# EAGLE design MSMGDustSensor (EAGLE 8.3.1)
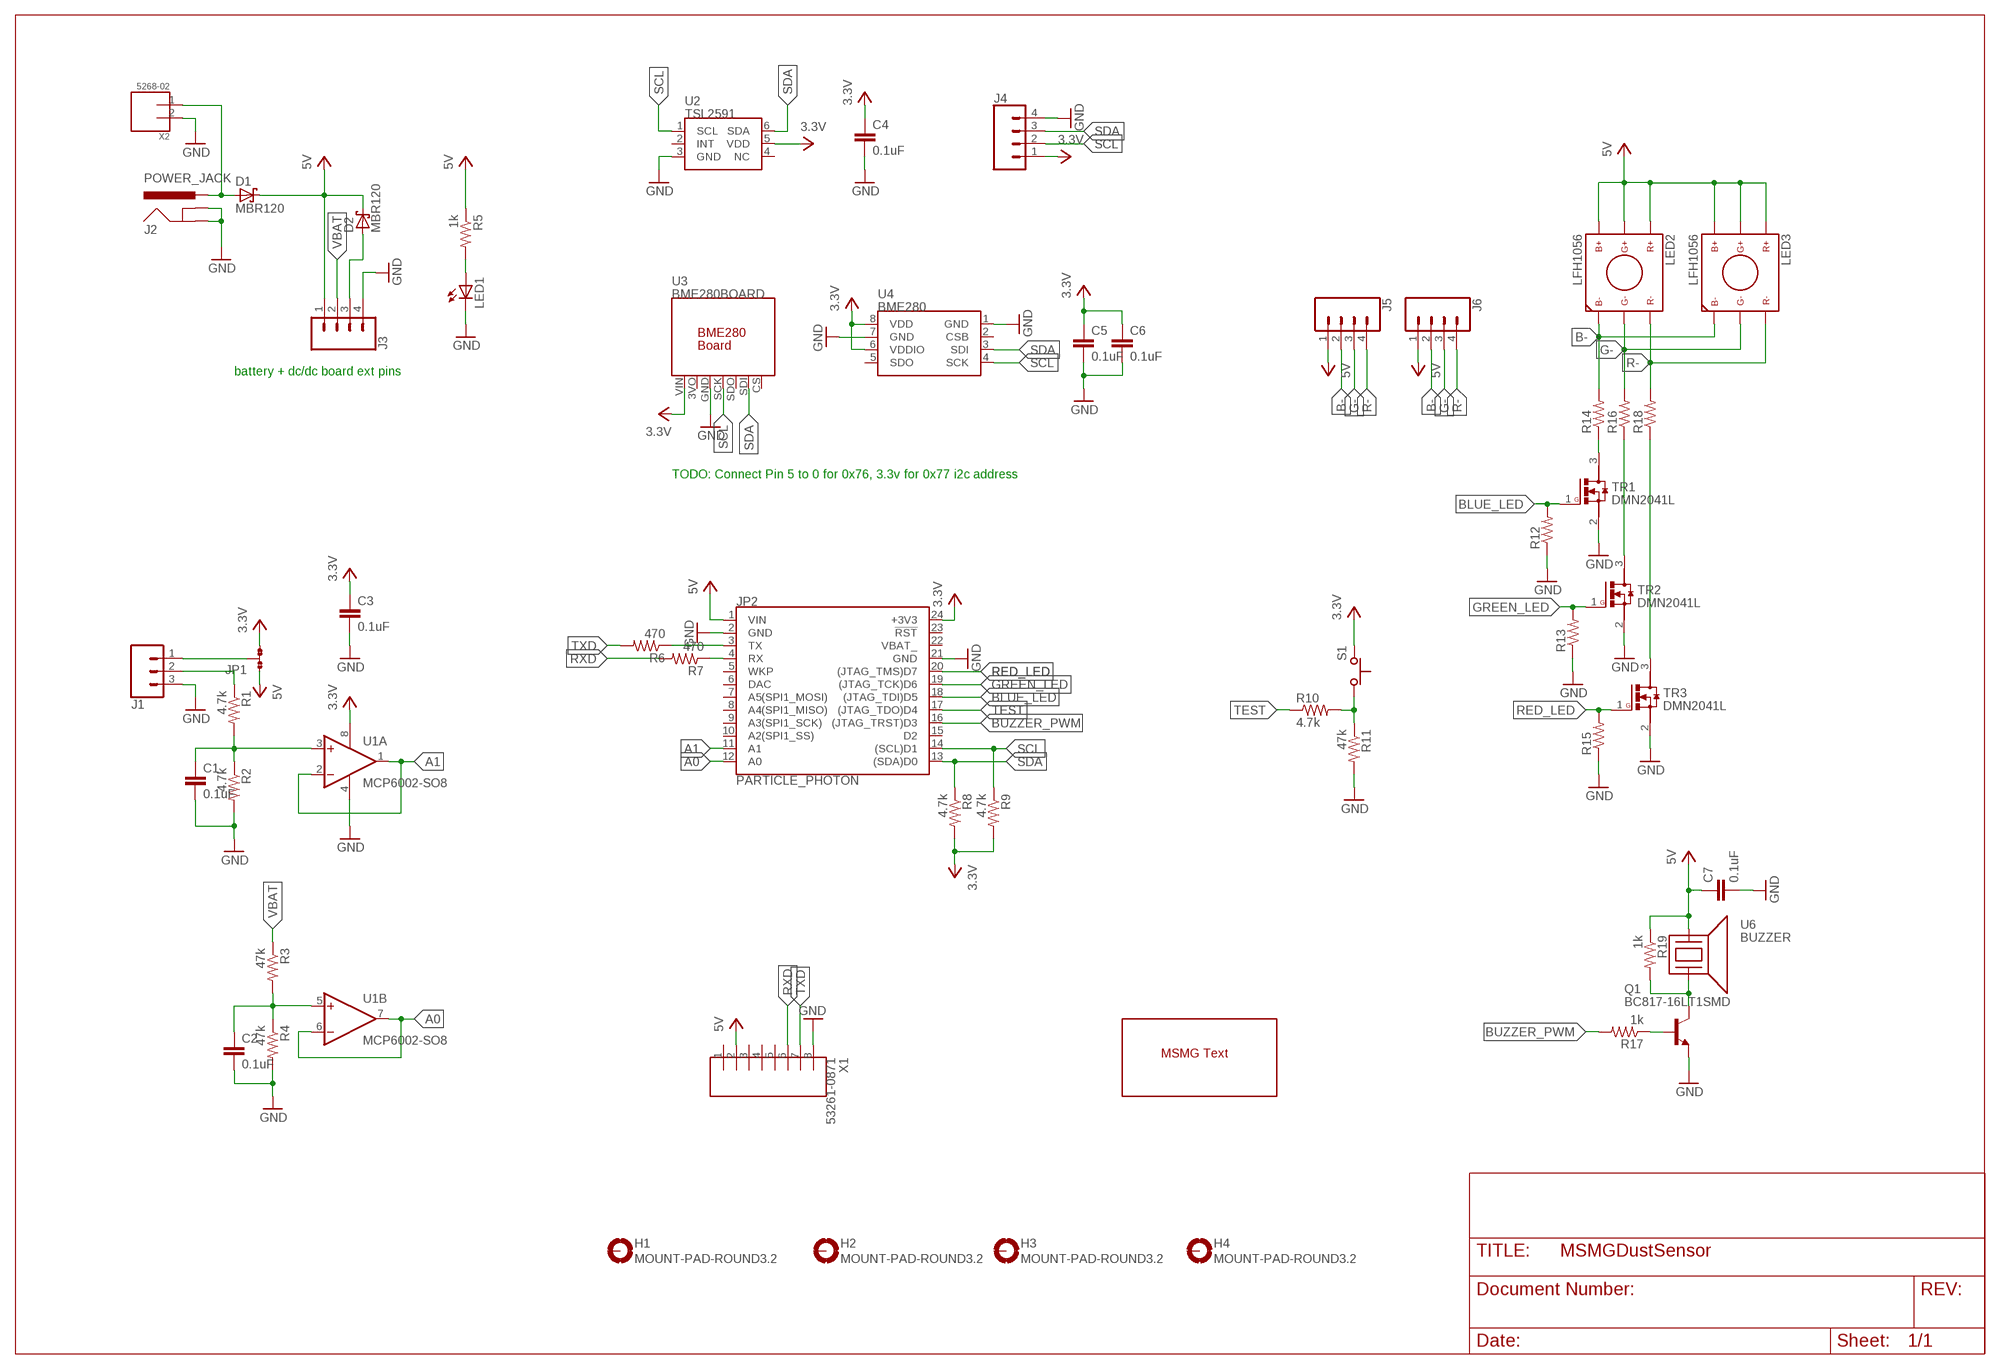
[diagram p0: schematic, sheet 1]

## Parts
C1  0.1uF  C0603(1608)  [C0603(1608)]
C2  0.1uF  C0603(1608)  [C0603(1608)]
C3  0.1uF  C0603(1608)  [C0603(1608)]
C4  0.1uF  C0603(1608)  [C0603(1608)]
C5  0.1uF  C0603(1608)  [C0603(1608)]
C6  0.1uF  C0603(1608)  [C0603(1608)]
C7  0.1uF  C0603(1608)  [C0603(1608)]
D1  MBR120  [SOD-123]
D2  MBR120  [SOD-123]
H1  MOUNT-PAD-ROUND3.2  [3,2-PAD]
H2  MOUNT-PAD-ROUND3.2  [3,2-PAD]
H3  MOUNT-PAD-ROUND3.2  [3,2-PAD]
H4  MOUNT-PAD-ROUND3.2  [3,2-PAD]
J1  CONN_03  [1X03]
J2  POWER_JACK  [POWER_JACK_PTH]
J3  CONN_04  [1X04]
J4  CONN_04  [1X04]
J5  CONN_04  [1X04]
J6  CONN_04  [1X04]
JP1  JP2  [JP2SMD0603]
JP2  PARTICLE_PHOTON  [PARTICLE_PHOTON]
LED1  LED3MM  [LED3MM]
LED2  LFH1056  [LFH1056]
LED3  LFH1056  [LFH1056]
Q1  BC817-16LT1SMD  [SOT23-BEC]
R1  4.7k  R0603(1608)  [R0603(1608)]
R2  4.7k  R0603(1608)  [R0603(1608)]
R3  47k  R0603(1608)  [R0603(1608)]
R4  47k  R0603(1608)  [R0603(1608)]
R5  1k  R0603(1608)  [R0603(1608)]
R6  470  R0603(1608)  [R0603(1608)]
R7  470  R0603(1608)  [R0603(1608)]
R8  4.7k  R0603(1608)  [R0603(1608)]
R9  4.7k  R0603(1608)  [R0603(1608)]
R10  4.7k  R0603(1608)  [R0603(1608)]
R11  47k  R0603(1608)  [R0603(1608)]
R12  R0603(1608)  [R0603(1608)]
R13  R0603(1608)  [R0603(1608)]
R14  R0603(1608)  [R0603(1608)]
R15  R0603(1608)  [R0603(1608)]
R16  R0603(1608)  [R0603(1608)]
R17  1k  R0603(1608)  [R0603(1608)]
R18  R0603(1608)  [R0603(1608)]
R19  1k  R0603(1608)  [R0603(1608)]
S1  SWITCH  [SKHLACA010]
TR1  DMN2041L  [SOT23]
TR2  DMN2041L  [SOT23]
TR3  DMN2041L  [SOT23]
U1  MCP6002-SO8  [SO8]
U2  TSL2591  [DFN-6]
U3  BME280BOARD  [BME280BOARD]
U4  BME280  [BME280]
U6  BUZZER  [PS1240]
U$1  MSMG_TEXT  [MSMG_TEXT]
X1  53261-0871  [53261-0871]
X2  5268-02  [5628-02]

## Nets
3.3V: C3.1 C4.1 C5.1 C6.1 J4.1 JP1.3 JP2.24(+3V3) R8.2 R9.2 S1.P$1 U1.8(V+) U2.5(VDD) U3.VIN U4.6(VDDIO) U4.8(VDD)
5V: C7.1 D1.C D2.C J3.1 J5.1 J6.1 JP1.1 JP2.1(VIN) LED2.B+ LED2.G+ LED2.R+ LED3.B+ LED3.G+ LED3.R+ R5.1 R19.1 U6.1 X1.2
A0: JP2.12(A0) U1.6(B:-IN) U1.7(B:OUT)
A1: JP2.11(A1) U1.1(A:OUT) U1.2(A:-IN)
B-: J5.2 J6.2 LED2.B- LED3.B- R14.2
BLUE_LED: JP2.18((JTAG_TDI)D5) R12.2 TR1.1(G)
BUZZER_PWM: JP2.16((JTAG_TRST)D3) R17.2
G-: J5.3 J6.3 LED2.G- LED3.G- R16.2
GND: C1.2 C2.2 C3.2 C4.2 C5.2 C6.2 C7.2 J1.3 J2.GND J2.GNDBREAK J3.4 J4.4 JP2.2(GND) JP2.21(GND) LED1.K(C) Q1.E R2.2 R4.2 R11.2 R12.1 R13.1 R15.1 TR1.2(S) TR2.2(S) TR3.2(S) U1.4(V-) U2.3(GND) U3.GND U4.1(GND) U4.7(GND) X1.8 X2.2
GREEN_LED: JP2.19((JTAG_TCK)D6) R13.2 TR2.1(G)
N$1: D1.A J2.PWR X2.1
N$2: D2.A J3.3
N$4: J1.2 R1.1
N$5: JP2.3(TX) R6.1
N$7: J1.1 JP1.2
N$9: JP2.4(RX) R7.1
N$10: R14.1 TR1.3(D)
N$11: R10.2 R11.1 S1.P$2
N$12: R16.1 TR2.3(D)
N$13: Q1.C R19.2 U6.2
N$14: C2.1 R3.2 R4.1 U1.5(B:+IN)
N$15: R18.1 TR3.3(D)
N$16: C1.1 R1.2 R2.1 U1.3(A:+IN)
N$17: LED1.A R5.2
N$18: Q1.B R17.1
R-: J5.4 J6.4 LED2.R- LED3.R- R18.2
RED_LED: JP2.20((JTAG_TMS)D7) R15.2 TR3.1(G)
RXD: R7.2 X1.6
SCL: J4.2 JP2.14((SCL)D1) R9.1 U2.1(SCL) U3.SCK U4.4(SCK)
SDA: J4.3 JP2.13((SDA)D0) R8.1 U2.6(SDA) U3.SDI U4.3(SDI)
TEST: JP2.17((JTAG_TDO)D4) R10.1
TXD: R6.2 X1.7
VBAT: J3.2 R3.1
Unconnected: H1.B3,2(MOUNT) H2.B3,2(MOUNT) H3.B3,2(MOUNT) H4.B3,2(MOUNT) JP2.5(WKP) JP2.6(DAC) JP2.7(A5(SPI1_MOSI)) JP2.8(A4(SPI1_MISO)) JP2.9(A3(SPI1_SCK)) JP2.10(A2(SPI1_SS)) JP2.15(D2) JP2.23(!RST!) U2.2(INT) U2.4(NC) U3.3VO U3.CS U3.SDO U4.2(CSB) U4.5(SDO) X1.1 X1.3 X1.4 X1.5

## Notes on the sheet
- battery + dc/dc board ext pins
- TODO: Connect Pin 5 to 0 for 0x76, 3.3v for 0x77 i2c address

## Power pins joined to a net without a drawn wire
VBAT_: JP2.22(VBAT_)

## Library data of the parts
C1-C7 = MSMG:C
D1 D2 = MSMG:MBR120
H1-H4 = holes:MOUNT-PAD-ROUND: MOUNTING PAD, round
J1 = SparkFun-Connectors:CONN_03: Multi connection point. Often used as Generic Header-pin footprint for 0.1 inch spaced/style header connections On any of the 0.1 inch spaced packages, you can populate with these: Break Away Headers - Straight <https://www.sparkfun.com/products/116> (PRT-00116) Break Away Male Headers - Right Angle <https://www.sparkfun.com/products/553> (PRT-00553) Female Headers <https://www.sparkfun.com/products/115> (PRT-00115) Break Away Headers - Machine Pin <https://www.sparkfun.com/products/117> (PRT-00117) Break Away Female Headers - Swiss Machine Pin <https://www.sparkfun.com/products/743> (PRT-00743) Stackable Header - 3 Pin (Female, 0.1") <https://www.sparkfun.com/products/13875> (PRT-13875) For SCREWTERMINALS and SPRING TERMINALS visit here: Screw Terimnals on SparkFun.com <https://www.sparkfun.com/search/results?term=Screw+Terminals> (5mm/3.5mm/2.54mm spacing) This device is also useful as a general connection point to wire up your design to another part of your project. Our various solder wires solder well into these plated through hole pads. Hook-Up Wire - Assortment (Stranded, 22 AWG) <https://www.sparkfun.com/products/11375> (PRT-11375) Hook-Up Wire - Assortment (Solid Core, 22 AWG) <https://www.sparkfun.com/products/11367> (PRT-11367) View the entire wire category on our website here <https://www.sparkfun.com/categories/141> Special notes: Molex polarized connector foot print use with SKU : PRT-08232 with associated crimp pins and housings.
J2 = MSMG:POWER_JACK: Power Jack Connector This is the standard 5.5mm barrel jack for power. The PTH is the most common, proven, reliable, footprint. The Slot footprint only works if the mill layer is transmitted to the PCB fab house so be warned. Here are the connectors we sell at SparkFun: DC Barrel Power Jack/Connector <https://www.sparkfun.com/products/119> (PRT-00119) DC Barrel Power Jack/Connector (SMD) <https://www.sparkfun.com/products/12748> (PRT-12748) DC Barrel Jack Adapter - Breadboard Compatible <https://www.sparkfun.com/products/10811> (PRT-10811) It is used on this SparkFun product (and many, many others): SparkFun RedBoard - Programmed with Arduino <https://www.sparkfun.com/products/12757> (DEV-12757) Also, if you need a mating power supply or connector, please check these out: Wall Adapter Power Supply - 9VDC 650mA <https://www.sparkfun.com/products/298> (TOL-00298) DC Barrel Jack Adapter - Male <https://www.sparkfun.com/products/10287> (PRT-10287); PROD_ID: CONN-08197
J3-J6 = SparkFun-Connectors:CONN_04: Multi connection point. Often used as Generic Header-pin footprint for 0.1 inch spaced/style header connections On any of the 0.1 inch spaced packages, you can populate with these: Break Away Headers - Straight <https://www.sparkfun.com/products/116> (PRT-00116) Break Away Male Headers - Right Angle <https://www.sparkfun.com/products/553> (PRT-00553) Female Headers <https://www.sparkfun.com/products/115> (PRT-00115) Break Away Headers - Machine Pin <https://www.sparkfun.com/products/117> (PRT-00117) Break Away Female Headers - Swiss Machine Pin <https://www.sparkfun.com/products/743> (PRT-00743) For SCREWTERMINALS and SPRING TERMINALS visit here: Screw Terimnals on SparkFun.com <https://www.sparkfun.com/search/results?term=Screw+Terminals> (5mm/3.5mm/2.54mm spacing) This device is also useful as a general connection point to wire up your design to another part of your project. Our various solder wires solder well into these plated through hole pads. Hook-Up Wire - Assortment (Stranded, 22 AWG) <https://www.sparkfun.com/products/11375> (PRT-11375) Hook-Up Wire - Assortment (Solid Core, 22 AWG) <https://www.sparkfun.com/products/11367> (PRT-11367) View the entire wire category on our website here <https://www.sparkfun.com/categories/141> Special notes: Molex polarized connector foot print use with SKU : PRT-08231 with associated crimp pins and housings. 1MM SMD Version SKU: PRT-10208; PROD_ID: CONN-09696
JP1 = GFE:JP2
JP2 = MSMG:PARTICLE_PHOTON: Particle Photon Footprint of the Particle Photon that is used as a basis for many Photon shields. SparkFun Products: Particle Photon <https://www.sparkfun.com/products/13764> SparkFun Photon ProtoShield <https://www.sparkfun.com/products/13598> SparkFun Photon micro OLED Shield <https://www.sparkfun.com/products/13628> SparkFun Photon IMU Shield <https://www.sparkfun.com/products/13629> SparkFun Photon Battery Shield <https://www.sparkfun.com/products/13626>
LED1 = MSMG:LED: LEDs Standard schematic elements and footprints for 5mm, 3mm, 1206, and 0603 sized LEDs. 5mm - Spark Fun Electronics SKU : COM-00529 (and others)
LED2 LED3 = MSMG:LFH1056: Luxpia LFH1056
Q1 = MSMG:BC817*: NPN Transistor
R1-R19 = MSMG:R
S1 = WaterDrop:SWITCH
TR1-TR3 = MSMG:DMN2041L
U1 = MSMG:MCP6002
U2 = MSMG:TSL2591
U3 = MSMG:BME280BOARD
U4 = MSMG:BME280: BME280 - Environmental Sensor (I2C + SPI)
U6 = MSMG:BUZZER
U$1 = MSMG:MSMG_TEXT
X1 = MSMG:53261-0871
X2 = OSSI:5268-02

## Board
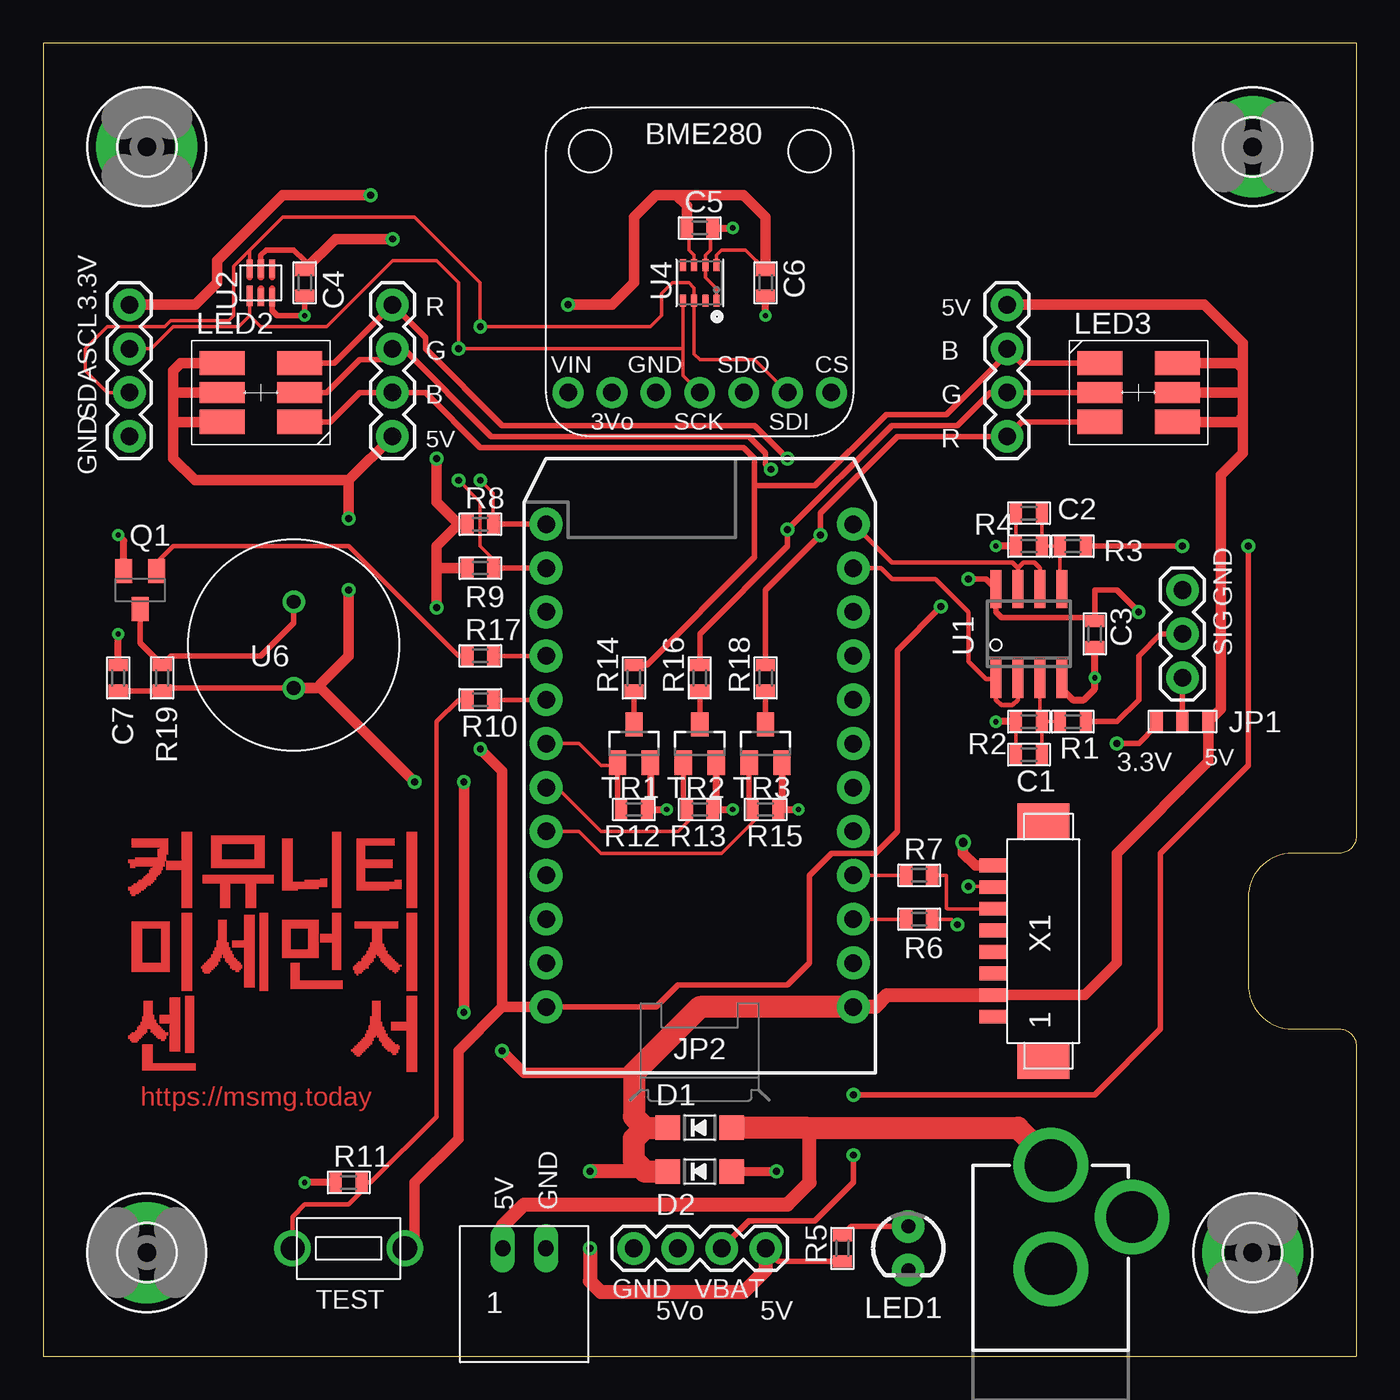
[diagram p1: board, top side]
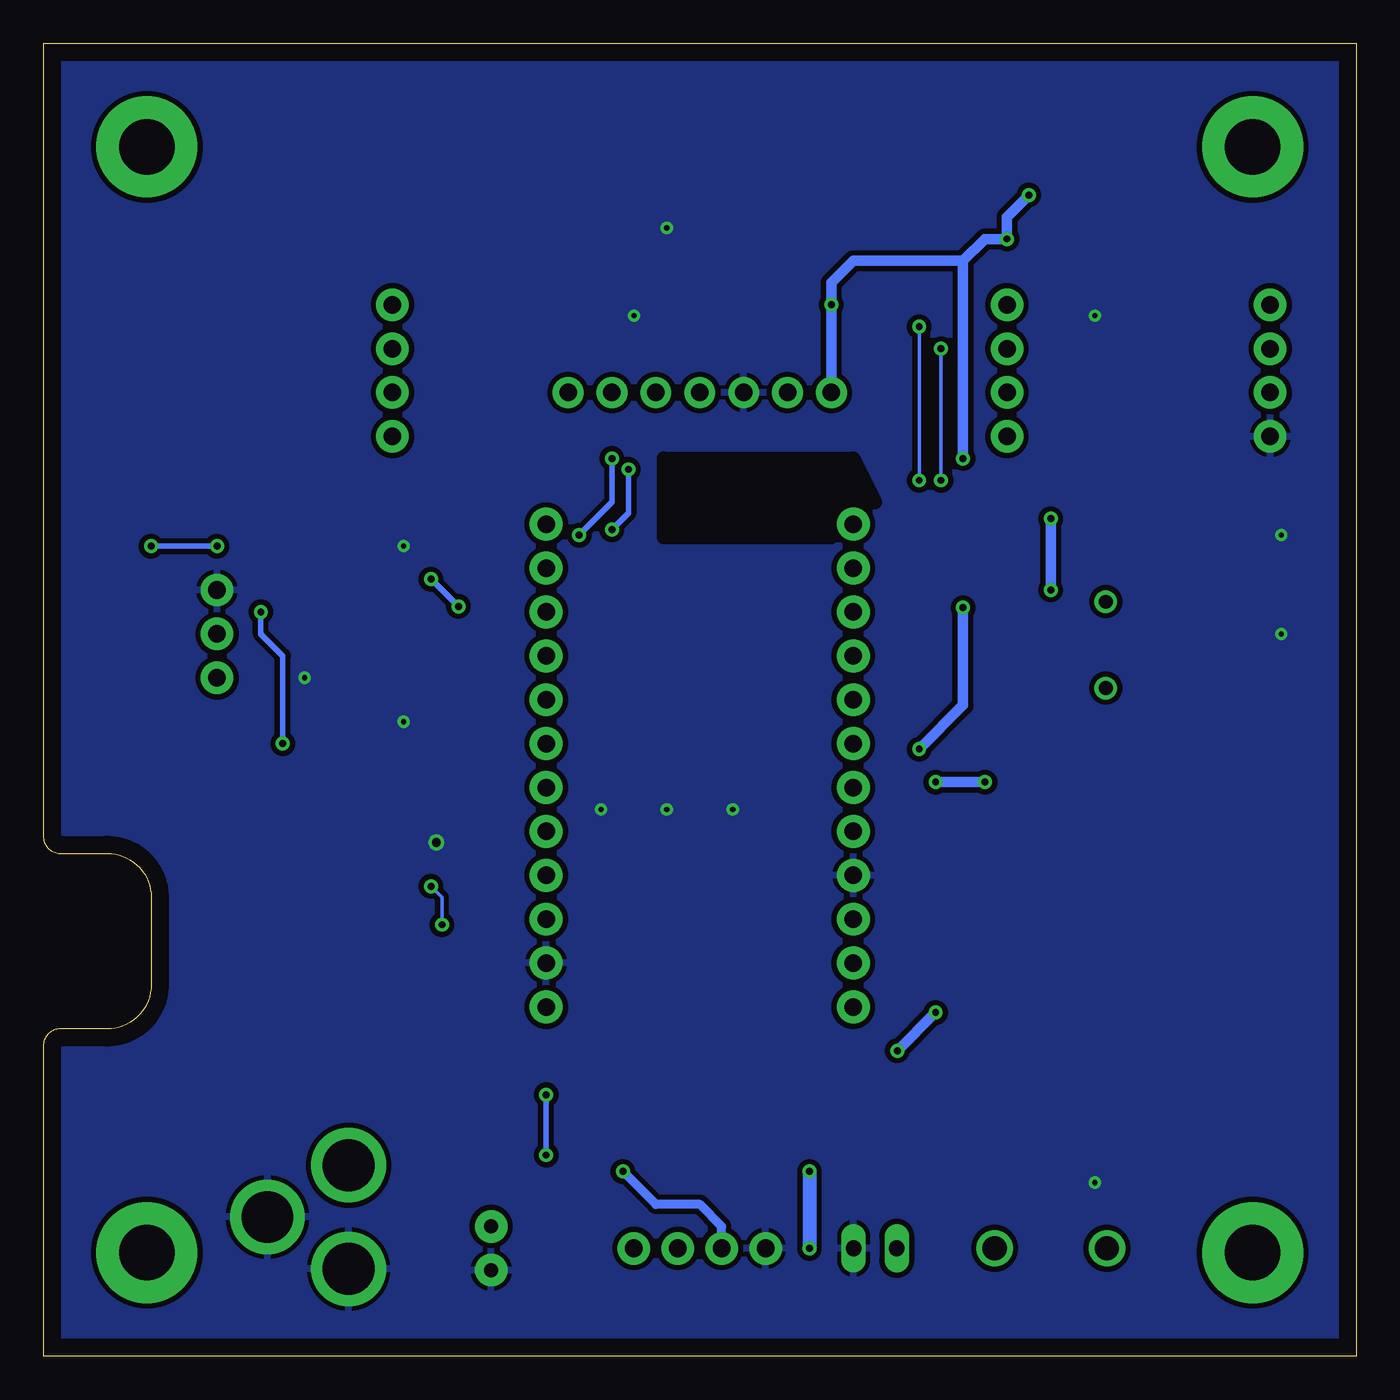
[diagram p2: board, bottom side, seen from below]

Size 76 x 76 mm. Coordinates in mm from the lower left corner, seen from the top.
Outline: 0,0 76,0 76,17.95 arc90 75,18.95 72.29,18.95 arc-90 69.75,21.49 69.75,26.57 arc-90 72.29,29.11 75,29.11 arc90 76,30.11 76,76 0,76 0,0
Copper layers (1*16): Top 0.035mm / dielectric 1.5mm / Bottom 0.035mm
Design rules "default *": minimum track width 6mil, minimum drill 0.3mm, track to track 6mil, track to pad 6mil, pad to pad 6mil, via to via 6mil, smd to smd 6mil, copper to edge 40mil, drill to drill 6mil, minimum pad ring 10mil, minimum via ring 8mil, stop-mask expansion 4mil, vias tented up to drill 0mil, thermal gap 10mil

### Footprints (pad centres in the part's own frame; a part is rotated, then mirrored left to right if it is on the bottom)
C0603(1608) = smd 0.7 x 1.1: 1 -0.75,0; 2 0.75,0
SOD-123 = smd 1.4 x 1.4: A 1.85,0; C -1.85,0
3,2-PAD = drill 3.2 pad 5.842: B3,2 0,0
1X03 = drill 1.016 pad 1.88: 1 0,0; 2 2.54,0; 3 5.08,0
POWER_JACK_PTH = drill 2.997 pad 4.318: GND 0,7.7; GNDBREAK 4.7,10.7; PWR 0,13.7
1X04 = drill 1.016 pad 1.88: 1 0,0; 2 2.54,0; 3 5.08,0; 4 7.62,0
JP2SMD0603 = smd 0.7 x 1.1: 1 -1.5,0; 2 0,0; 3 1.5,0
PARTICLE_PHOTON = drill 1.016 pad 1.905: 1 -8.89,13.97; 2 -8.89,11.43; 3 -8.89,8.89; 4 -8.89,6.35; 5 -8.89,3.81; 6 -8.89,1.27; 7 -8.89,-1.27; 8 -8.89,-3.81; 9 -8.89,-6.35; 10 -8.89,-8.89; 11 -8.89,-11.43; 12 -8.89,-13.97; 13 8.89,-13.97; 14 8.89,-11.43; 15 8.89,-8.89; 16 8.89,-6.35; 17 8.89,-3.81; 18 8.89,-1.27; 19 8.89,1.27; 20 8.89,3.81; 21 8.89,6.35; 22 8.89,8.89; 23 8.89,11.43; 24 8.89,13.97
LED3MM = drill 0.813 pad 1.88: A -1.27,0; K 1.27,0
LFH1056 = smd 2.6 x 1.4: B+ -2.25,-1.7; B- 2.25,-1.7; R+ -2.25,1.7; R- 2.25,1.7 | smd 2.6 x 1.2: G+ -2.25,0; G- 2.25,0
SOT23-BEC = smd 1 x 1.4: B -0.95,-1.1; C 0,1.1; E 0.95,-1.1
R0603(1608) = smd 0.7 x 1.1: 1 -0.75,0; 2 0.75,0
SKHLACA010 = drill 1.4: P$1 -3.25,0; P$2 3.25,0
SOT23 = smd 1 x 1.4: 1 -0.95,-1.1; 2 0.95,-1.1; 3 0,1.1
SO8 = smd 0.65 x 2.2: 1 -1.905,-2.6; 2 -0.635,-2.6; 3 0.635,-2.6; 4 1.905,-2.6; 5 1.905,2.6; 6 0.635,2.6; 7 -0.635,2.6; 8 -1.905,2.6
DFN-6 = smd 1.2 x 0.35: 1 -0.75,0.65 | smd 1.025 x 0.35: 2 -0.838,0; 3 -0.838,-0.65; 4 0.838,-0.65; 5 0.838,0; 6 0.838,0.65
BME280BOARD = drill 1.016 pad 1.778: 3VO 3.81,2.54; CS 16.51,2.54; GND 6.35,2.54; SCK 8.89,2.54; SDI 13.97,2.54; SDO 11.43,2.54; VIN 1.27,2.54
BME280 = smd 0.7 x 0.35: 1 1.025,0.975; 2 1.025,0.325; 3 1.025,-0.325; 4 1.025,-0.975; 5 -1.025,-0.975; 6 -1.025,-0.325; 7 -1.025,0.325; 8 -1.025,0.975
PS1240 = drill 0.8: 1 -2.5,0; 2 2.5,0
53261-0871 = smd 0.8 x 1.6: 1 -4.375,0.8; 2 -3.125,0.8; 3 -1.875,0.8; 4 -0.625,0.8; 5 0.625,0.8; 6 1.875,0.8; 7 3.125,0.8; 8 4.375,0.8 | smd 2.1 x 3: P$9 -6.925,-2.1; P$10 6.925,-2.1
5628-02 = drill 0.9 long: 1 1.25,0; 2 -1.25,0

### Placement (x,y rotation side)
C1  57.05,34.83 180 top
C2  57.05,48.8 180 top
C3  60.86,41.81 270 top
C4  15.14,62.13 270 top
C5  38,65.31 0 top
C6  41.81,62.13 270 top
C7  4.34,39.27 90 top
D1  38,13.23 0 top
D2  38,10.7 0 top
H1  6,70 45 top
H2  70,6 45 top
H3  6,6 315 top
H4  70,70 315 top
J1  65.94,39.27 90 top
J2  58.32,-2.64 0 top
J3  41.81,6.25 180 top
J4  4.98,60.86 270 top
J5  20.22,53.24 90 top
J6  55.78,60.86 270 top
JP1  65.94,36.73 180 top
JP2  38,34.19 180 top
LED1  50.06,6.25 270 top
LED2  12.6,55.78 0 top
LED3  63.4,55.78 180 top
Q1  5.62,44.35 180 top
R1  59.59,36.73 180 top
R2  57.05,36.73 180 top
R3  59.59,46.89 180 top
R4  57.05,46.89 180 top
R5  46.26,6.25 90 top
R6  50.7,25.3 0 top
R7  50.7,27.84 0 top
R8  25.3,48.16 180 top
R9  25.3,45.62 180 top
R10  25.3,38 180 top
R11  17.68,10.06 180 top
R12  34.19,31.65 180 top
R13  38,31.65 180 top
R14  34.19,39.27 90 top
R15  41.81,31.65 180 top
R16  38,39.27 90 top
R17  25.3,40.54 0 top
R18  41.81,39.27 90 top
R19  6.89,39.27 90 top
S1  17.68,6.25 180 top
TR1  34.19,35.46 0 top
TR2  38,35.46 0 top
TR3  41.81,35.46 0 top
U1  57.05,41.81 0 top
U2  12.6,62.13 90 top
U3  29.11,53.24 0 top
U4  38,62.13 270 top
U6  14.5,41.17 90 top
U$1  4.98,16.41 0 top
X1  55.78,24.03 90 top
X2  27.84,6.25 180 top

### Tracks (layer width: path | path; a pad name or v marks a point on that pad's centre or on a via)
3.3V  (via drill 0.4)
  Top 0.2: U4.6 37.67,63.73 37.37,64.03 37.37,65.19 C5.1 | U4.8 38.98,63.74 39.27,64.03 40.66,64.03 C6.1
  Top 0.305: C4.1 15.14,63.4 14.5,64.03 12.92,64.03 12.6,63.72 U2.5 | JP2.24 35.46,20.22 36.73,21.49 43.08,21.49 44.35,22.76 44.35,27.84 45.62,29.11 48.16,29.11 49.43,30.38 49.43,40.86 v51.97,43.4 | v53.56,44.98 54.57,44.98 U1.8 55.14,43.08 55.46,42.76 60.66,42.76 C3.1 60.86,44.35 62.13,44.35 v63.4,43.08 | JP1.3 64.44,36.5 63.4,35.46 v62.13,35.46
  Top 0.61: 26.57,20.22 JP2.24 | 26.57,20.22 24.03,17.68 24.03,12.6 21.49,10.06 21.49,6.81 S1.P$1 | 26.57,20.22 26.57,33.87 v25.3,35.14 | 22.76,45.62 v22.76,43.33 | 22.76,45.62 22.76,46.89 24.03,48.16 | R9.2 22.76,45.62 | R8.2 24.03,48.16 | 24.03,48.16 22.76,49.43 v22.76,51.97 | v20.22,64.67 16.93,64.67 C4.1 | C6.1 41.81,65.94 40.54,67.21 36.63,67.21 | 36.63,67.21 35.46,67.21 34.19,65.94 34.19,62.13 32.92,60.86 v30.38,60.86 | C5.1 37.25,66.59 36.63,67.21 | J4.1 8.79,60.86 10.06,62.13 10.06,63.4 13.87,67.21 v18.95,67.21
  Bottom 0.305: v51.97,43.4 v53.56,44.98 | v62.13,35.46 62.13,40.54 63.4,41.81 v63.4,43.08
  Bottom 0.61: v25.3,35.14 22.76,37.68 v22.76,43.33 22.76,43.4 | 22.76,63.31 v22.76,51.97 | 22.76,63.31 22.76,63.4 21.49,64.67 20.42,64.67 | 20.42,64.67 v20.22,64.67 | U3.VIN v30.38,60.86 30.38,62.13 29.11,63.4 22.85,63.4 22.76,63.31 | v18.95,67.21 20.22,65.94 20.22,64.87 20.42,64.67
5V  (via drill 0.4)
  Top 0.305: U6.1 7.04,38.67 R19.1 C7.1 | R5.1 42.56,5.5 J3.1 | 35.46,10.7 35.47,10.7
  Top 0.61: X1.2 60.27,20.91 62.13,22.76 62.13,29.11 67.44,34.42 JP1.1 68.16,37.45 68.16,51.02 69.43,52.29 69.43,54.38 | J6.1 67.21,60.86 69.43,58.64 69.43,57.17 | 69.43,55.97 69.43,57.17 | 69.43,54.38 69.43,55.97 | LED3.B+ 69.12,57.48 69.43,57.17 | LED3.G+ 69.24,55.78 69.43,55.97 | LED3.R+ 69.13,54.08 69.43,54.38 | LED2.R+ 7.95,57.48 7.52,57.05 7.52,55.57 | 7.52,54.1 7.52,55.57 | 7.52,54.1 7.52,51.97 8.79,50.7 17.68,50.7 | LED2.G+ 7.73,55.78 7.52,55.57 | LED2.B+ 7.54,54.08 7.52,54.1 | 17.68,50.7 J5.1 | 34.19,16.41 27.84,16.41 v26.57,17.68 | v24.35,19.9 v24.35,33.24 | U6.1 16.05,38.67 | 16.05,38.67 v21.49,33.24 | 16.05,38.67 16.05,38.91 17.68,40.54 v17.68,44.35 | v17.68,48.48 17.68,50.7
  Top 0.813: X1.2 48.84,20.91 48.16,20.22 JP2.1 | J3.1 41.81,4.98 40.54,3.71 32.28,3.71 31.65,4.34 v31.65,6.25 | 35.46,10.7 v31.65,10.7
  Top 1.27: 34.83,13.23 D1.C | 34.83,13.23 34.19,12.6 34.19,11.33 34.83,10.7 35.46,10.7 | 35.47,10.7 D2.C | JP2.1 38,20.22 34.19,16.41 34.19,13.87 34.83,13.23
  Bottom 0.61: v26.57,17.68 v24.35,19.9 | v24.35,33.24 v21.49,33.24 | v17.68,44.35 v17.68,48.48
  Bottom 0.813: v31.65,10.7 v31.65,6.25
A0
  Top 0.254: U1.6 57.69,45.62 57.37,45.94 56.73,45.94 56.41,45.62 | 56.41,45.62 U1.7 | JP2.12 49.11,45.94 56.1,45.94 56.41,45.62
A1
  Top 0.254: U1.2 56.41,38 56.1,37.68 55.46,37.68 55.14,38 U1.1 54.57,39.21 53.56,40.22 53.56,43.08 51.65,44.98 49.11,44.98 48.48,45.62 JP2.11
B-
  Top 0.305: LED3.B- 56.62,57.48 J6.2 55.78,58 52.29,54.51 48.8,54.51 44.67,50.38 41.17,50.38 | LED2.B- 16.61,54.08 18.32,55.78 J5.2 22.12,55.78 25.3,52.61 40.54,52.61 41.17,51.97 41.17,50.38 | 41.17,50.38 41.17,46.26 34.94,40.02 R14.2
BLUE_LED
  Top 0.2: JP2.18 31.02,35.46 32.28,34.19 33.07,34.19 TR1.1
  Top 0.305: TR1.1 33.24,31.85 R12.2
BUZZER_PWM
  Top 0.254: JP2.16 R17.2
G-  (via drill 0.4)
  Top 0.305: LED3.G- J6.3 54.83,55.78 52.92,53.88 49.11,53.88 v43.08,47.84 43.08,46.89 38,41.81 R16.2 | LED2.G- 16.41,55.78 18.32,57.69 19.59,57.69 J5.3 20.86,58.32 25.94,53.24 40.86,53.24 41.81,52.29 41.81,51.65 v42.13,51.34
  Bottom 0.305: v42.13,51.34 42.13,48.8 v43.08,47.84
GND  (via drill 0.3, 0.5)
  Top 0.2: C1.2 R2.2 | C2.2 R4.2 | C5.2 38.63,65.19 38.63,64.03 38.33,63.73 U4.7 38.33,62.44 38.98,61.79 U4.1
  Top 0.305: C4.2 v15.14,60.23 13.55,60.23 13.25,60.53 U2.3
  Top 0.406: 34.99,31.65 v36.09,31.65 | 34.99,31.65 R12.1 | TR1.2 35.14,31.8 34.99,31.65 | 38.89,31.65 v39.91,31.65 | 38.89,31.65 R13.1 | TR2.2 38.95,31.71 38.89,31.65 | 42.74,31.65 v43.72,31.65 | 42.74,31.65 R15.1 | TR3.2 42.76,31.67 42.74,31.65 | C7.2 v4.34,41.81 | Q1.E 4.66,47.2 v4.34,47.52 | R11.2 v15.14,10.06 | C3.2 v60.86,39.27 60.86,38.63 60.23,38 59.59,38 58.95,38.63 U1.4 | R4.2 v55.14,46.89 | R2.2 v55.14,36.73 | v41.81,60.23 C6.2 | C5.2 v39.91,65.31
  Top 0.61: X1.8 53.95,28.41 53.24,29.11 v53.24,29.74
  pour Bottom (isolate 0.305): -0.1,76.1 75.85,76.1 arc-90 76.1,75.85 76.1,-0.1 0.15,-0.1 arc-90 -0.1,0.15
GREEN_LED
  Top 0.2: JP2.19 29.74,32.92 32.28,30.38 36.73,30.38 37.37,31.02 37.37,31.54 R13.2
  Top 0.305: TR2.1 37.05,31.85 R13.2
N$1
  Top 0.813: X2.1 26.59,7.54 27.84,8.79 43.08,8.79 44.35,10.06 44.35,13.01 44.12,13.23
  Top 1.27: D1.A 44.12,13.23 56.41,13.23 58.32,11.33 J2.PWR
N$2  (via drill 0.4)
  Top 0.508: D2.A v42.45,10.7
  Bottom 0.508: J3.3 36.73,7.52 38,8.79 40.54,8.79 v42.45,10.7
N$4
  Top 0.305: J1.2 64.67,41.81 63.4,40.54 63.4,38 62.13,36.73 R1.1
N$5
  Top 0.2: JP2.3 R6.1
N$7
  Top 0.305: JP1.2 J1.1
N$9
  Top 0.2: R7.1 JP2.4
N$10
  Top 0.305: R14.1 TR1.3
N$11
  Top 0.254: S1.P$2 14.43,8.08 15.14,8.79 17.68,8.79 18.43,9.54 18.43,9.98 | 18.43,9.98 R11.1 | R10.2 24.03,38 22.76,36.73 22.76,13.87 18.95,10.06 18.51,10.06 18.43,9.98
N$12
  Top 0.305: R16.1 TR2.3
N$13
  Top 0.305: Q1.C 5.62,41.29 R19.2 7.41,40.54 12.6,40.54 14.5,42.45 U6.2
N$14
  Top 0.2: C2.1 R4.1 R3.2 58.84,44.52 U1.5
N$15
  Top 0.305: R18.1 TR3.3
N$16
  Top 0.2: U1.3 57.69,36.84 R2.1 | R1.2 R2.1 | C1.1 R2.1
N$17
  Top 0.305: LED1.A 46.77,7.52 R5.2
N$18
  Top 0.254: Q1.B 6.57,45.94 7.52,46.89 17.68,46.89 24.03,40.54 R17.1
R-  (via drill 0.4)
  Top 0.305: LED3.R- 56.62,54.08 J6.4 49.43,53.24 44.98,48.8 v44.98,47.52 41.81,44.35 R18.2 | LED2.R- 16.84,57.48 J5.4 22.12,58.95 22.12,58.32 26.57,53.88 41.17,53.88 v43.08,51.97
  Bottom 0.305: v43.08,51.97 43.08,49.43 v44.98,47.52
RED_LED
  Top 0.2: JP2.20 31.02,30.38 32.28,29.11 39.27,29.11 41.17,31.02 41.17,31.54 R15.2
  Top 0.305: TR3.1 40.86,31.85 R15.2
RXD
  Top 0.2: 52.29,25.95 52.29,25.94 | 52.29,25.95 52.29,27.84 R7.2 | X1.6 52.33,25.91 52.29,25.95
SCL  (via drill 0.4)
  Top 0.2: 37.02,58.36 U4.4 | 37.02,58.36 37.02,56.75 U3.SCK | R9.1 26.05,46.14 25.3,46.89 25.3,49.43 v24.03,50.7 | 37.02,58.36 36.98,58.32 v24.03,58.32 24.03,62.13 22.76,63.4 20.22,63.4 16.41,59.59 12.6,59.59 11.95,60.24 | 11.95,60.24 U2.1 | J4.2 6.25,58.32 7.52,59.59 11.3,59.59 11.95,60.24
  Top 0.305: JP2.14 R9.1
  Bottom 0.2: v24.03,50.7 v24.03,58.32
SDA  (via drill 0.4)
  Top 0.2: U3.SDI 41.17,57.69 38,57.69 37.67,58.01 U4.3 37.67,61.82 37.37,62.13 36.41,62.13 35.78,61.5 35.78,60.23 35.14,59.59 v25.3,59.59 25.3,62.13 21.49,65.94 13.87,65.94 12.02,64.09 | JP2.13 27.84,48.16 | R8.1 26.05,49.95 v25.3,50.7 | 12.02,64.09 11.95,64.02 U2.6 | J4.3 3.71,55.78 2.44,57.05 2.44,58.32 3.71,59.59 7.02,59.59 7.37,59.94 10.73,59.94 11.01,60.23 11.01,63.08 12.02,64.09
  Top 0.305: JP2.13 R8.1
  Bottom 0.2: v25.3,50.7 v25.3,59.59
TEST
  Top 0.254: JP2.17 R10.1
TXD  (via drill 0.4)
  Top 0.2: R6.2 52.61,25.3 v52.92,24.98 | v53.56,27.2 54.93,27.2 X1.7
  Bottom 0.2: v52.92,24.98 52.92,26.57 v53.56,27.2
VBAT  (via drill 0.4)
  Top 0.305: J3.2 40.86,7.84 44.67,7.84 46.89,10.06 v46.89,11.65 | v46.89,15.14 60.86,15.14 64.67,18.95 64.67,29.11 69.75,34.19 v69.75,46.89 | R3.1 v65.94,46.89
  Bottom 0.305: v69.75,46.89 v65.94,46.89 | v46.89,11.65 v46.89,15.14

### Text on the board
Top: https://msmg.today
tPlace: 3.3V | R | 5V | G | B | SCL | B | G | SDA | 5V | R | GND | GND | SIG | 3.3V | 5V | 5V | GND | TEST | GND | VBAT | 5Vo | 5V
tStop: https://msmg.today
tCream: https://msmg.today